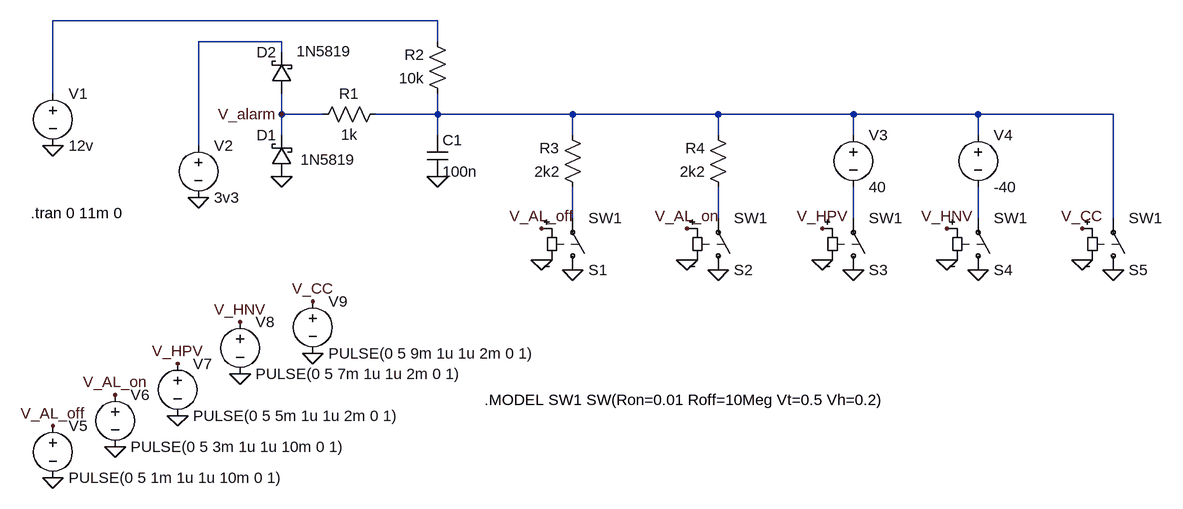
[diagram p0: schematic Circuito anti vandalismo en entrada de alarma.asc]
Circuito anti vandalismo en entrada de alarma.asc, the LTspice schematic file:
Version 4
SHEET 1 1648 708
WIRE 528 -16 -64 -16
WIRE 288 16 160 16
WIRE 528 16 528 -16
WIRE 288 32 288 16
WIRE -64 96 -64 -16
WIRE 288 128 288 96
WIRE 352 128 288 128
WIRE 528 128 528 96
WIRE 528 128 432 128
WIRE 736 128 528 128
WIRE 960 128 736 128
WIRE 1168 128 960 128
WIRE 1360 128 1168 128
WIRE 1568 128 1360 128
WIRE 288 160 288 128
WIRE 528 160 528 128
WIRE 736 160 736 128
WIRE 960 160 960 128
WIRE 1168 160 1168 128
WIRE 1360 160 1360 128
WIRE 160 176 160 16
WIRE 736 288 736 240
WIRE 960 288 960 240
WIRE 1168 288 1168 240
WIRE 1360 288 1360 240
WIRE 1568 288 1568 128
FLAG -64 176 0
FLAG 160 256 0
FLAG 288 224 0
FLAG 528 224 0
FLAG 736 368 0
FLAG 960 368 0
FLAG 1168 368 0
FLAG 1360 368 0
FLAG 688 304 V_AL_off
FLAG -64 608 V_AL_off
FLAG 32 560 V_AL_on
FLAG 912 304 V_AL_on
FLAG 224 528 0
FLAG 128 592 0
FLAG 32 640 0
FLAG -64 688 0
FLAG 912 352 0
FLAG 1120 352 0
FLAG 1312 352 0
FLAG 688 352 0
FLAG 128 512 V_HPV
FLAG 1120 304 V_HPV
FLAG 224 448 V_HNV
FLAG 1312 304 V_HNV
FLAG 1568 368 0
FLAG 1520 352 0
FLAG 336 496 0
FLAG 336 416 V_CC
FLAG 1520 304 V_CC
FLAG 288 128 V_alarm
SYMBOL voltage -64 80 R0
SYMATTR InstName V1
SYMATTR Value 12v
SYMBOL voltage 160 160 R0
SYMATTR InstName V2
SYMATTR Value 3v3
SYMBOL schottky 304 224 R180
WINDOW 0 24 64 Left 2
WINDOW 3 -98 26 Left 2
SYMATTR InstName D1
SYMATTR Value 1N5819
SYMATTR Description Diode
SYMATTR Type diode
SYMBOL schottky 304 96 R180
WINDOW 0 24 64 Left 2
WINDOW 3 -92 65 Left 2
SYMATTR InstName D2
SYMATTR Value 1N5819
SYMATTR Description Diode
SYMATTR Type diode
SYMBOL res 448 112 R90
WINDOW 0 0 56 VBottom 2
WINDOW 3 32 56 VTop 2
SYMATTR InstName R1
SYMATTR Value 1k
SYMBOL res 544 112 R180
WINDOW 0 36 76 Left 2
WINDOW 3 36 40 Left 2
SYMATTR InstName R2
SYMATTR Value 10k
SYMBOL res 752 256 R180
WINDOW 0 36 76 Left 2
WINDOW 3 36 40 Left 2
SYMATTR InstName R3
SYMATTR Value 2k2
SYMBOL res 976 256 R180
WINDOW 0 36 76 Left 2
WINDOW 3 36 40 Left 2
SYMATTR InstName R4
SYMATTR Value 2k2
SYMBOL cap 512 160 R0
SYMATTR InstName C1
SYMATTR Value 100n
SYMBOL voltage 1168 144 R0
SYMATTR InstName V3
SYMATTR Value 40
SYMBOL sw 736 384 M180
SYMATTR InstName S1
SYMATTR Value SW1
SYMBOL sw 960 384 M180
SYMATTR InstName S2
SYMATTR Value SW1
SYMBOL sw 1168 384 M180
SYMATTR InstName S3
SYMATTR Value SW1
SYMBOL sw 1360 384 M180
SYMATTR InstName S4
SYMATTR Value SW1
SYMBOL voltage 1360 144 R0
SYMATTR InstName V4
SYMATTR Value -40
SYMBOL voltage -64 592 R0
WINDOW 123 0 0 Left 0
WINDOW 39 0 0 Left 0
SYMATTR InstName V5
SYMATTR Value PULSE(0 5 1m 1u 1u 10m 0 1)
SYMBOL voltage 32 544 R0
WINDOW 123 0 0 Left 0
WINDOW 39 0 0 Left 0
SYMATTR InstName V6
SYMATTR Value PULSE(0 5 3m 1u 1u 10m 0 1)
SYMBOL voltage 128 496 R0
WINDOW 123 0 0 Left 0
WINDOW 39 0 0 Left 0
SYMATTR InstName V7
SYMATTR Value PULSE(0 5 5m 1u 1u 2m 0 1)
SYMBOL voltage 224 432 R0
WINDOW 123 0 0 Left 0
WINDOW 39 0 0 Left 0
SYMATTR InstName V8
SYMATTR Value PULSE(0 5 7m 1u 1u 2m 0 1)
SYMBOL sw 1568 384 M180
SYMATTR InstName S5
SYMATTR Value SW1
SYMBOL voltage 336 400 R0
WINDOW 123 0 0 Left 0
WINDOW 39 0 0 Left 0
SYMATTR InstName V9
SYMATTR Value PULSE(0 5 9m 1u 1u 2m 0 1)
TEXT -98 280 Left 2 !.tran 0 11m 0
TEXT 600 568 Left 2 !.MODEL SW1 SW(Ron=0.01 Roff=10Meg Vt=0.5 Vh=0.2)

The netlist it stands for:
* Circuito anti vandalismo en entrada de alarma.asc
V1 N001 0 12v
V2 N002 0 3v3
D1 0 V_alarm 1N5819
D2 V_alarm N002 1N5819
R1 N003 V_alarm 1k
R2 N003 N001 10k
R3 N004 N003 2k2
R4 N005 N003 2k2
C1 N003 0 100n
V3 N003 N006 40
S1 0 N004 V_AL_off 0 SW1
S2 0 N005 V_AL_on 0 SW1
S3 0 N006 V_HPV 0 SW1
S4 0 N007 V_HNV 0 SW1
V4 N003 N007 -40
V5 V_AL_off 0 PULSE(0 5 1m 1u 1u 10m 0 1)
V6 V_AL_on 0 PULSE(0 5 3m 1u 1u 10m 0 1)
V7 V_HPV 0 PULSE(0 5 5m 1u 1u 2m 0 1)
V8 V_HNV 0 PULSE(0 5 7m 1u 1u 2m 0 1)
S5 0 N003 V_CC 0 SW1
V9 V_CC 0 PULSE(0 5 9m 1u 1u 2m 0 1)
.model D D
.lib standard.dio
.tran 0 11m 0
.MODEL SW1 SW(Ron=0.01 Roff=10Meg Vt=0.5 Vh=0.2)
.backanno
.end